# Altium schematic sheet dog.SchDoc: a_card
size A4; Author: 劉東輝; SheetNumber: 2; SheetTotal: 5; Unit: 看门狗; Edition: V1.5
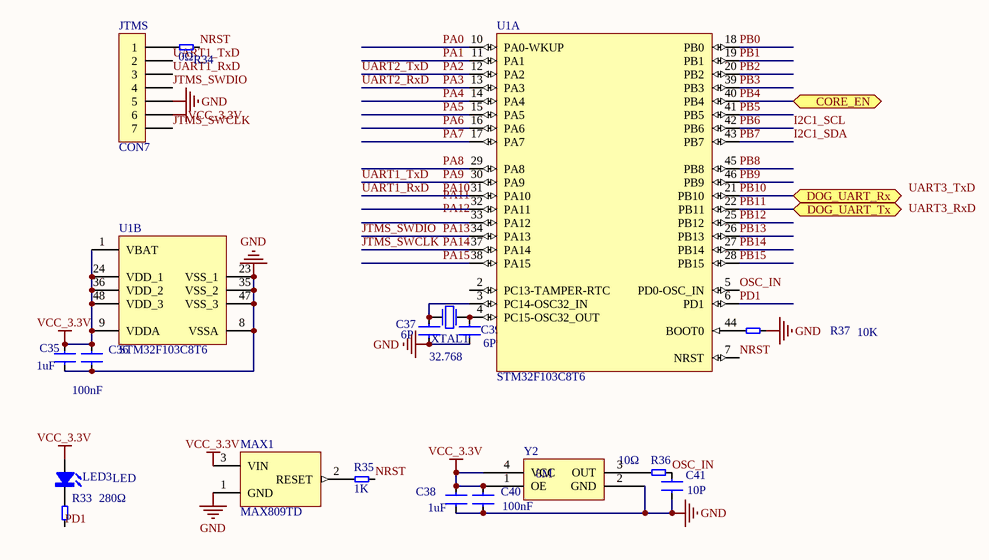
[diagram p0: dog.SchDoc]

## Parts
C35  1uF  [0805/2012 C3]
C36  100nF  [0805/2012 C3]
C37  6P  [0805/2012 C3]
C38  1uF  [0805/2012 C3]
C39  6P  [0805/2012 C3]
C40  100nF  [0805/2012 C3]
C41  10P  [0805/2012 C3]
JTMS  CON7  [JTMS]
LED3  LED  [0805/2012 LEDB]
MAX1  MAX809TD  [SOT-23 Q2]
R33  280Ω  [0805/2012 R3]
R34  0Ω  [0805/2012 R3]
R35  1K  [0805/2012 R3]
R36  10Ω  [0805/2012 R3]
R37  10K  [0805/2012 R3]
U1  STM32F103C8T6  [LQFP-48L]  (parts A,B of 2)
XTAL1  32.768  [Y_3215-2]
Y2  8M  [Y_3225-4]

## Ports
CORE_EN (bidir), DOG_UART_Rx (bidir), DOG_UART_Tx (bidir)

## Nets
GND: C35.1 C36.1 C37.1 C38.1 C39.1 C40.1 C41.1 JTMS.5 MAX1.1(GND) R37.2 U1.8(VSSA) U1.23(VSS_1) U1.35(VSS_2) U1.47(VSS_3) Y2.2(GND)
VCC_3.3V: C35.2 C36.2 C38.2 C40.2 JTMS.6 LED3.1(A) MAX1.3(VIN) U1.1(VBAT) U1.9(VDDA) U1.24(VDD_1) U1.36(VDD_2) U1.48(VDD_3) Y2.1(OE) Y2.4(VCC)
I2C1_SCL: U1.42(PB6)  [also labelled PB6]
I2C1_SDA: U1.43(PB7)  [also labelled PB7]
JTMS_SWCLK: JTMS.7 U1.37(PA14)  [also labelled PA14]
JTMS_SWDIO: JTMS.4 U1.34(PA13)  [also labelled PA13]
NRST: R34.2 R35.2 U1.7(NRST)
OSC_IN: C41.2 R36.1 U1.5(PD0-OSC_IN)
PA0: U1.10(PA0-WKUP)
PA1: U1.11(PA1)
PA2: U1.12(PA2)  [also labelled UART2_TxD]
PA3: U1.13(PA3)  [also labelled UART2_RxD]
PA4: U1.14(PA4)
PA5: U1.15(PA5)
PA6: U1.16(PA6)
PA7: U1.17(PA7)
PA8: U1.29(PA8)
PA9: JTMS.2 U1.30(PA9)  [also labelled UART1_TxD]
PA10: JTMS.3 U1.31(PA10)  [also labelled UART1_RxD]
PA15: U1.38(PA15)
PB0: U1.18(PB0)
PB1: U1.19(PB1)
PB2: U1.20(PB2)
PB3: U1.39(PB3)
PB4: U1.40(PB4) ; port CORE_EN
PB5: U1.41(PB5)
PB8: U1.45(PB8)
PB9: U1.46(PB9)
PB10: U1.21(PB10) ; port DOG_UART_Rx
PB11: U1.22(PB11) ; port DOG_UART_Tx
PB12: U1.25(PB12)
PB13: U1.26(PB13)
PB14: U1.27(PB14)
PB15: U1.28(PB15)
PD1: R33.2 U1.6(PD1)
NetC37_2: C37.2 U1.3(PC14-OSC32_IN) XTAL1.1(P1)
NetC39_2: C39.2 U1.4(PC15-OSC32_OUT) XTAL1.2(P2)
NetJTMS_1: JTMS.1 R34.1
NetLED3_2: LED3.2(K) R33.1
NetMAX1_2: MAX1.2(RESET) R35.1
NetR36_2: R36.2 Y2.3(OUT)
NetR37_1: R37.1 U1.44(BOOT0)

Not connected (* = marked no-connect by the designer): U1 2(PC13-TAMPER-RTC) 32(PA11) 33(PA12)

## Notes on the sheet
- Labels drawn without touching a wire or pin: PA11, PA12, UART3_RxD, UART3_TxD
- 项目:
- 作者:
- 总张数:
- 页码:
- 日期:
- 单元:
- 版本:

## Library data of the parts
C35 C38 = CAP4: 105
C36 C40 = CAP4: 104
C37 C39 C41 = CAP4: Capacitor
JTMS = CON7: 调试接口
LED3 = LED: 蓝; pin to pad: 1>2 2>1
MAX1 = MAX809/810: 复位芯片
R33-R37 = RES2: 精度5%
U1 = STM32F103C8T6: STM32 ARM-based 32-bit MCU Performance Line with 64 kB Flash, 20 kB Internal RAM, -40 to +85癈 Temperature, 48-Pin LQFP, Tray; DatasheetVersion: rev13.0, Apr-2011; PackageVersion: rev13, Apr-2011; PackageReference: LQFP48; PackageDescription: 48-Pin Low-Profile Quad Flat Pack, 7 x 7 mm Body, 0.5 mm Pitch (LQFP48); ComponentLink1Description: Manufacturer URL; ComponentLink1URL: http://www.st.com/; ComponentLink2Description: STM32F103 Datasheet; ComponentLink2URL: http://www.st.com/internet/com/TECHNICAL_RESOURCES/TECHNICAL_LITERATURE/DATASHEET/CD00161566.pdf; ComponentLink3Description: STM32 Family Web Page; ComponentLink3URL: www.st.com/stm32
XTAL1 = XTAL: 32.768晶体
Y2 = XTAL-SPXO: 8M有源晶振